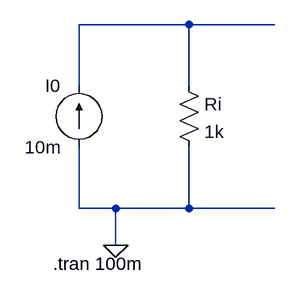
[diagram p0: schematic MOSFETCurrentMirrorNortonEquivalent.asc]
MOSFETCurrentMirrorNortonEquivalent.asc, the LTspice schematic file:
Version 4
SHEET 1 880 680
WIRE 160 16 16 16
WIRE 272 16 160 16
WIRE 16 96 16 16
WIRE 160 96 160 16
WIRE 16 256 16 176
WIRE 64 256 16 256
WIRE 160 256 160 176
WIRE 160 256 64 256
WIRE 272 256 160 256
WIRE 64 304 64 256
FLAG 64 304 0
SYMBOL current 16 176 R180
WINDOW 0 24 80 Left 2
WINDOW 3 24 0 Left 2
SYMATTR InstName I0
SYMATTR Value 10m
SYMBOL res 144 80 R0
SYMATTR InstName Ri
SYMATTR Value 1k
TEXT -18 328 Left 2 !.tran 100m

The netlist it stands for:
* MOSFETCurrentMirrorNortonEquivalent.asc
I0 0 N001 10m
Ri N001 0 1k
.tran 100m
.backanno
.end